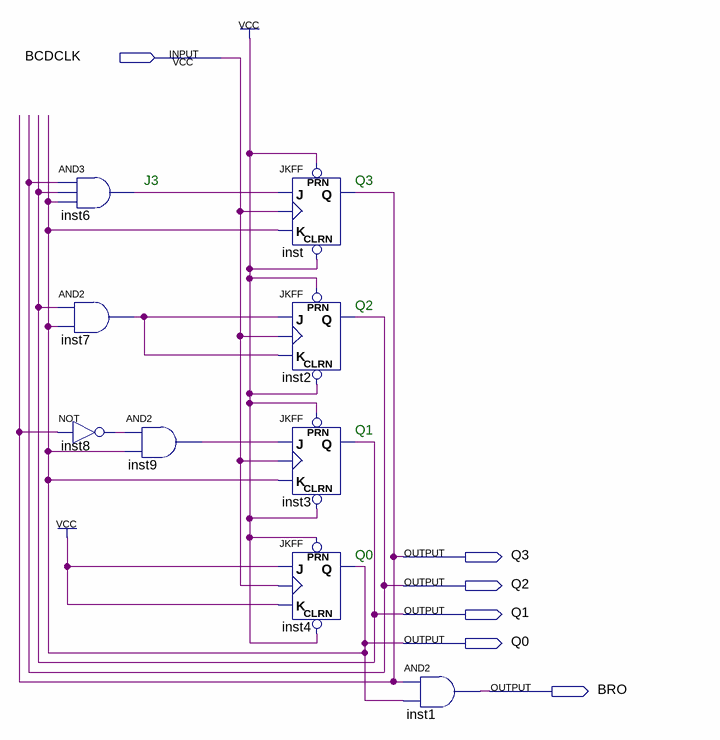
[diagram p0: schematic sheet]
// Quartus schematic BCD.bdf as structural Verilog: 9 symbols, 6 pins
module BCD (
  input  BCDCLK,
  output Q3,
  output Q2,
  output Q1,
  output Q0,
  output BRO
);

  wire inst6_out, inst7_out, inst8_out, inst9_out;

  and inst6 (inst6_out, Q2, Q1, Q0);
  and inst7 (inst7_out, Q1, Q0);
  not inst8 (inst8_out, Q3);
  and inst9 (inst9_out, inst8_out, Q0);
  JKFF inst (.PRN(1'b1), .CLRN(1'b1), .K(Q0), .J(inst6_out), .CLK(BCDCLK), .Q(Q3));
  JKFF inst2 (.PRN(1'b1), .CLRN(1'b1), .K(inst7_out), .J(inst7_out), .CLK(BCDCLK), .Q(Q2));
  JKFF inst3 (.PRN(1'b1), .CLRN(1'b1), .K(Q0), .J(inst9_out), .CLK(BCDCLK), .Q(Q1));
  JKFF inst4 (.PRN(1'b1), .CLRN(1'b1), .K(1'b1), .J(1'b1), .CLK(BCDCLK), .Q(Q0));
  and inst1 (BRO, Q3, Q0);

  // Notes on the sheet:
  //   J3
  //   Q3
  //   Q2
  //   Q1
  //   Q0
endmodule
